# Altium schematic sheet IO Peripherals.SchDoc
size A4; Revision: B.2(PCB.SCH)
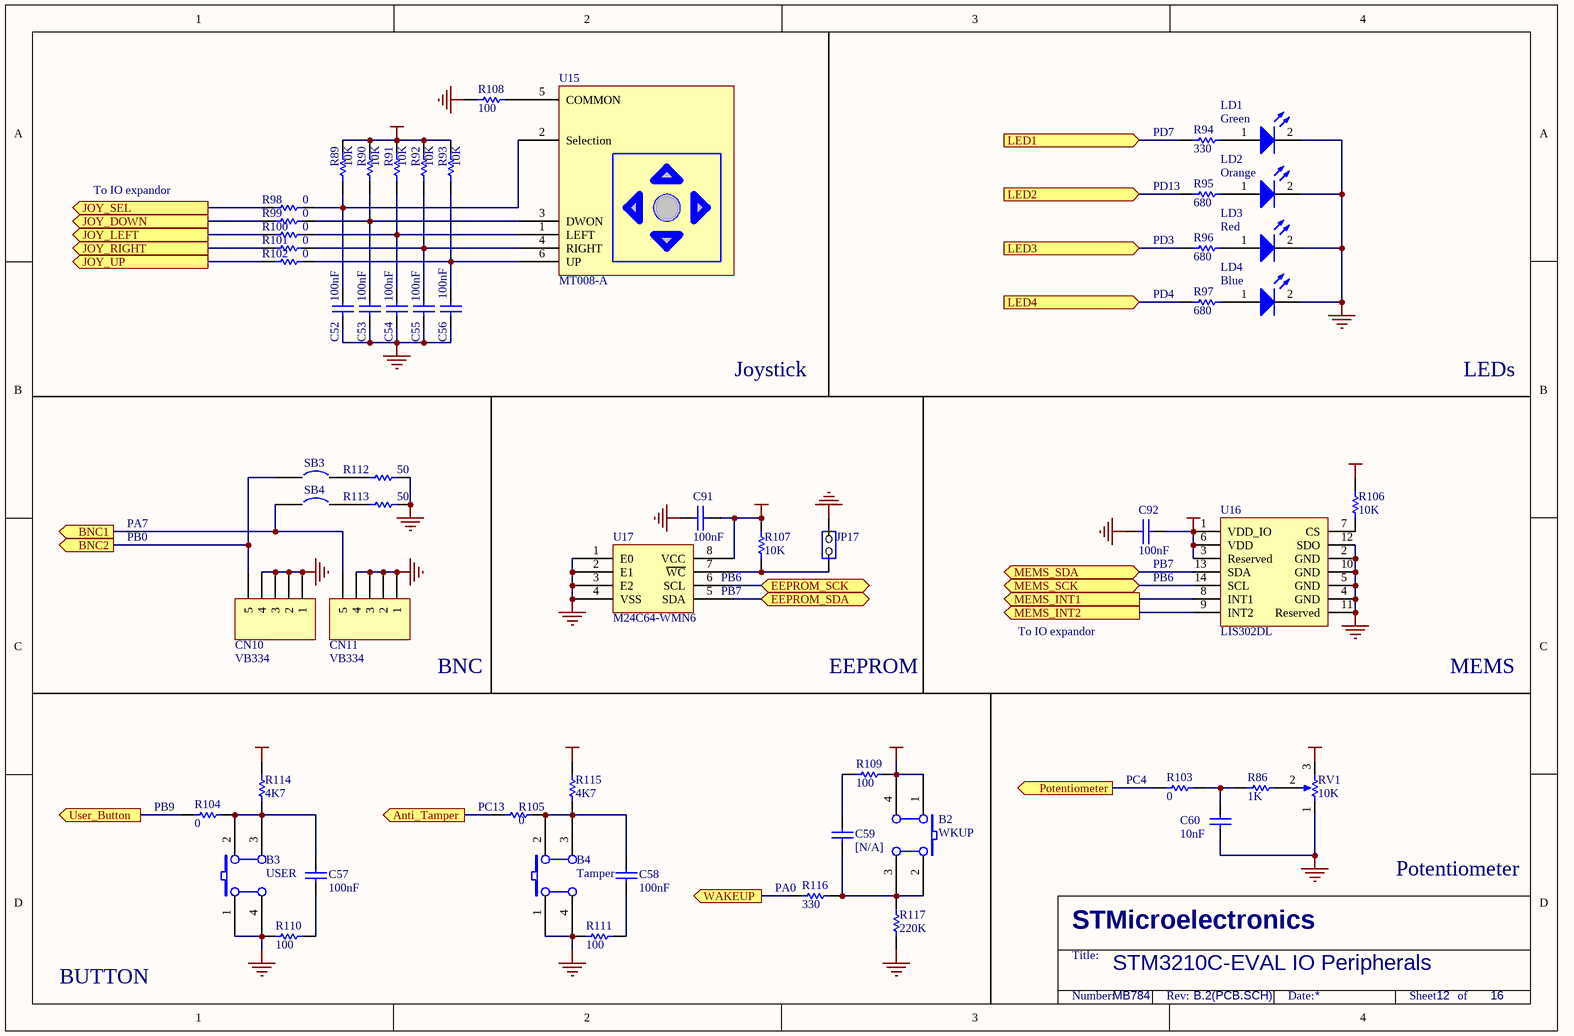
[diagram p0: IO Peripherals.SchDoc]

## Parts
B2  WKUP  [PB10]
B3  USER  [PB10]
B4  Tamper  [PB10]
C52  100nF  [0603C]
C53  100nF  [0603C]
C54  100nF  [0603C]
C55  100nF  [0603C]
C56  100nF  [0603C]
C57  100nF  [0603C]
C58  100nF  [0603C]
C59  [N/A]  [0603C]
C60  10nF  [0603C]
C91  100nF  [0603C]
C92  100nF  [0603C]
CN10  VB334  [VB334]
CN11  VB334  [VB334]
JP17  (no value)  [SIP2]
LD1  Green  [0603D]
LD2  Orange  [0603D]
LD3  Red  [0603D]
LD4  Blue  [0603D]
R86  1K  [0603R]
R89  10K  [0603R]
R90  10K  [0603R]
R91  10K  [0603R]
R92  10K  [0603R]
R93  10K  [0603R]
R94  330  [0603R]
R95  680  [0603R]
R96  680  [0603R]
R97  680  [0603R]
R98  0  [0603R]
R99  0  [0603R]
R100  0  [0603R]
R101  0  [0603R]
R102  0  [0603R]
R103  0  [0603R]
R104  0  [0603R]
R105  0  [0603R]
R106  10K  [0603R]
R107  10K  [0603R]
R108  100  [0603R]
R109  100  [0603R]
R110  100  [0603R]
R111  100  [0603R]
R112  50  [0603R]
R113  50  [0603R]
R114  4K7  [0603R]
R115  4K7  [0603R]
R116  330  [0603R]
R117  220K  [0603R]
RV1  10K  [ADJRH]
SB3  (no value)  [JP2_SMD]
SB4  (no value)  [JP2_SMD]
U15  MT008-A  [JOY]
U16  LIS302DL  [LGA14(3*5)]
U17  M24C64-WMN6  [SO8]

## Ports
Anti_Tamper (out), BNC1 (out), BNC2 (out), EEPROM_SCK (bidir), EEPROM_SDA (bidir), JOY_DOWN (out), JOY_LEFT (out), JOY_RIGHT (out), JOY_SEL (out), JOY_UP (out), LED1 (in), LED2 (in), LED3 (in), LED4 (in), MEMS_INT1 (out), MEMS_INT2 (out), MEMS_SCK (bidir), MEMS_SDA (bidir), Potentiometer (out), User_Button (out), WAKEUP (out)

## Nets
+3V3: B2.1(A0) B2.4(A1) C91.2 C92.2 R89.1 R90.2 R91.2 R92.2 R93.2 R106.1 R107.1 R109.1 R114.2 R115.2 RV1.3(TOP) U16.1(VDD_IO) U16.3(Reserved) U16.6(VDD) U17.8(VCC)
GND: B3.1(A0) B3.4(A1) B4.1(A0) B4.4(A1) C52.1 C53.1 C54.1 C55.1 C56.1 C60.1 C91.1 C92.1 CN10.1 CN10.2 CN10.3 CN10.4 CN11.1 CN11.2 CN11.3 CN11.4 JP17.2(NO) LD1.2(K) LD2.2(K) LD3.2(K) LD4.2(K) R108.1 R110.1 R111.1 R112.2 R113.2 R117.2 RV1.1(BOT) U16.2(GND) U16.4(GND) U16.5(GND) U16.10(GND) U16.11(Reserved) U16.12(SDO) U17.1(E0) U17.2(E1) U17.3(E2) U17.4(VSS)
Anti_Tamper: R105.2 ; port Anti_Tamper
BNC1: CN11.5 SB4.1 ; port BNC1
BNC2: CN10.5 SB3.1 ; port BNC2
EEPROM_SCK: U17.6(SCL) ; port EEPROM_SCK
EEPROM_SDA: U17.5(SDA) ; port EEPROM_SDA
JOY_DOWN: R99.2 ; port JOY_DOWN
JOY_LEFT: R100.2 ; port JOY_LEFT
JOY_RIGHT: R101.2 ; port JOY_RIGHT
JOY_SEL: R98.2 ; port JOY_SEL
JOY_UP: R102.2 ; port JOY_UP
LED1: R94.2 ; port LED1
LED2: R95.2 ; port LED2
LED3: R96.2 ; port LED3
LED4: R97.2 ; port LED4
MEMS_INT1: U16.8(INT1) ; port MEMS_INT1
MEMS_INT2: U16.9(INT2) ; port MEMS_INT2
MEMS_SCK: U16.14(SCL) ; port MEMS_SCK
MEMS_SDA: U16.13(SDA) ; port MEMS_SDA
Potentiometer: R103.1 ; port Potentiometer
User_Button: R104.2 ; port User_Button
WAKEUP: R116.2 ; port WAKEUP
NetB2_2: B2.2(B0) B2.3(B1) C59.2 R116.1 R117.1
NetB3_2: B3.2(B0) B3.3(B1) C57.2 R104.1 R114.1
NetB4_2: B4.2(B0) B4.3(B1) C58.2 R105.1 R115.1
NetC52_2: C52.2 R89.2 R98.1 U15.2(Selection)
NetC53_2: C53.2 R90.1 R99.1 U15.3(DWON)
NetC54_2: C54.2 R91.1 R100.1 U15.1(LEFT)
NetC55_2: C55.2 R92.1 R101.1 U15.4(RIGHT)
NetC56_2: C56.2 R93.1 R102.1 U15.6(UP)
NetC57_1: C57.1 R110.2
NetC58_1: C58.1 R111.2
NetC59_1: C59.1 R109.2
NetC60_2: C60.2 R86.1 R103.2
NetJP17_1: JP17.1(COMMON) R107.2 U17.7(~{WC})
NetLD1_1: LD1.1(A) R94.1
NetLD2_1: LD2.1(A) R95.1
NetLD3_1: LD3.1(A) R96.1
NetLD4_1: LD4.1(A) R97.1
NetR86_2: R86.2 RV1.2(TAP)
NetR106_2: R106.2 U16.7(CS)
NetR108_2: R108.2 U15.5(COMMON)
NetR112_1: R112.1 SB3.2
NetR113_1: R113.1 SB4.2

## Notes on the sheet
- (near R94) PD7
- To IO expandor
- (near R95) PD13
- (near R96) PD3
- (near R97) PD4
- Joystick
- LEDs
- PA7
- PB0
- PB6
- (near C92) PB7
- PB7
- BNC
- EEPROM
- MEMS
- (near R103) PC4
- (near R104) PB9
- (near R105) PC13
- (near R116) PA0
- Potentiometer
- BUTTON
- STM3210C-EVAL IO Peripherals
- MB784
- 12
- 16
- STMicroelectronics
- Title:
- Number:
- Rev:
- Date:
- Sheet       of

## Library data of the parts
B2-B4 = SW PUSHBUTTON: SE PUSHBUTTON
C52-C60 = CAP: Capacitor; Value: 100pF; Published: 8-Jun-2000; Revision: July-2002: Re-released for DXP Platform.; Publisher: Altium Limited
C91 C92 = CAP: Capacitor
CN10 CN11 = Header 5: Header, 5-Pin; Revision: 17-Jul-2002: Re-released for DXP Platform.; Publisher: Altium Limited
JP17 = JP2
LD1-LD4 = LED2: Typical RED, GREEN, YELLOW, AMBER GaAs LED; Published: 8-Jun-2000; Revision: July-2002: Re-released for DXP Platform.; Publisher: Altium Limited
R86 = Res1: Resistor; Published: 8-Jun-2000; Revision: July-2002: Re-released for DXP Platform.; Publisher: Altium Limited; Value: 1K
R89-R105 R108-R113 R116 = Res1: Resistor; Value: 1K; Published: 8-Jun-2000; Revision: July-2002: Re-released for DXP Platform.; Publisher: Altium Limited
R106 R107 R114 R115 R117 = res1: Resistor; Value: 1K; Published: 8-Jun-2000; Revision: July-2002: Re-released for DXP Platform.; Publisher: Altium Limited
RV1 = RV
SB3 SB4 = Circuit Breaker: Published: 24-Mar-1999; Revision: July-2002: Re-released for DXP Platform.; Publisher: Altium Limited
U15 = MT-008A